# Altium schematic sheet JN5169.SchDoc
size A4; Date: 1/11/2016; Engineer: JBayalas; DocumentNumber: 4; Revision: V2.0; SheetNumber: 4; SheetTotal: 14
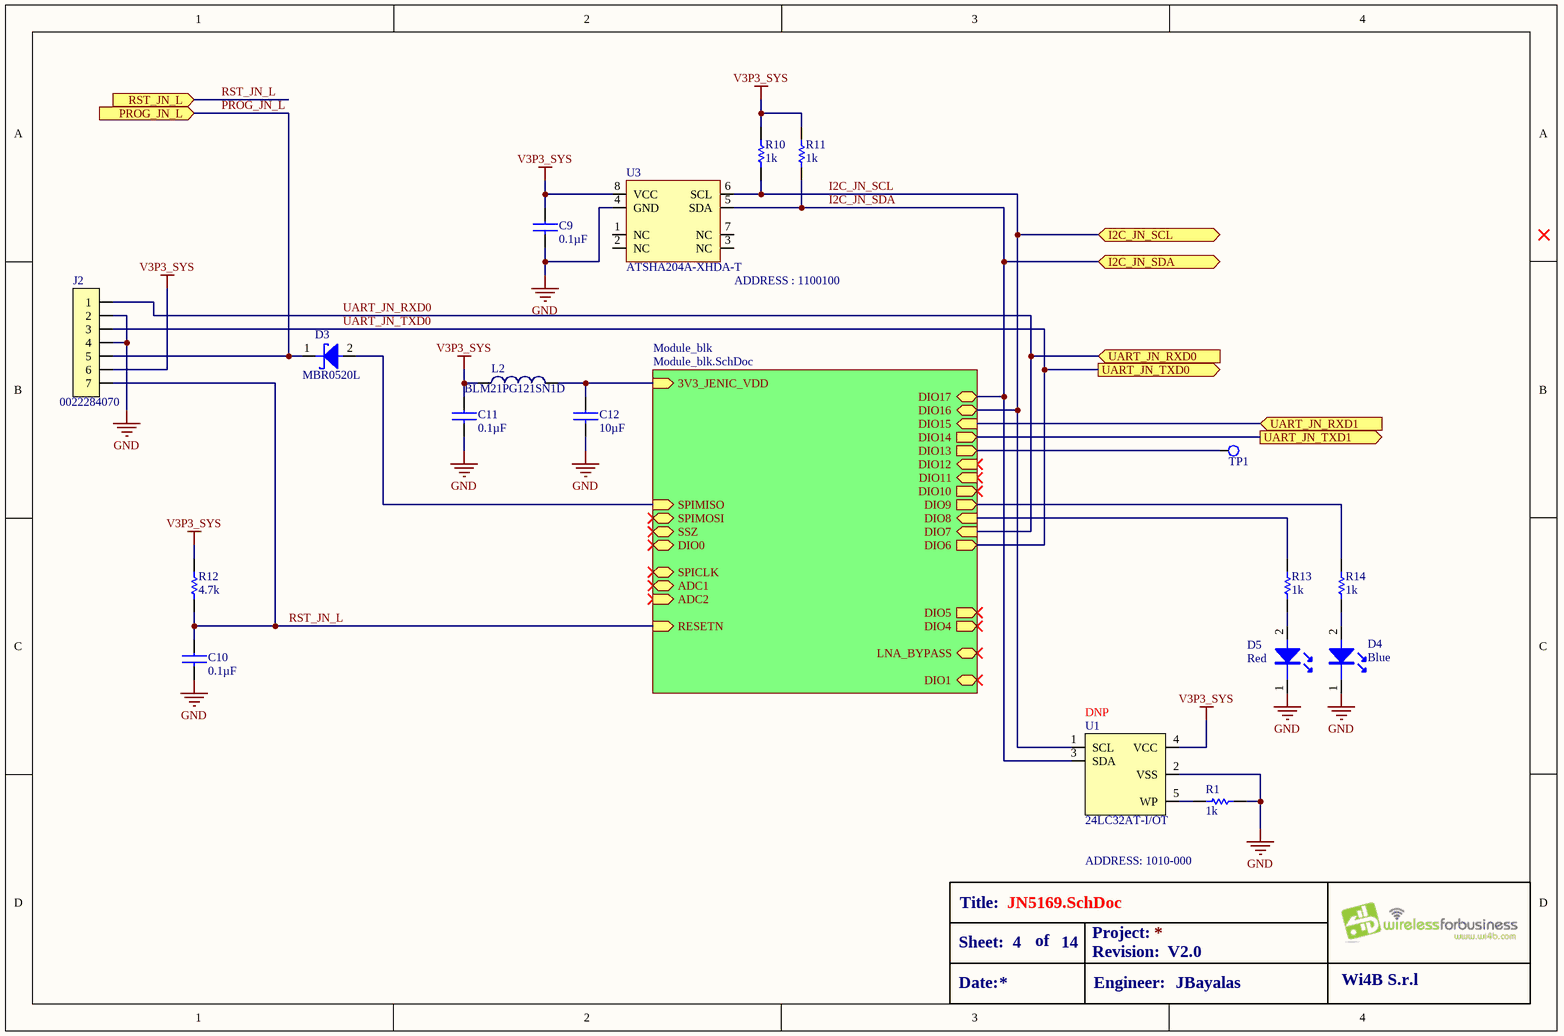
[diagram p0: JN5169.SchDoc]

## Parts
C9  value 0.1µF  [C0402]  (hidden comment: *)
C10  value 0.1µF  [C0402]  (hidden comment: *)
C11  value 0.1µF  [C0402]  (hidden comment: *)
C12  value 10µF  [C0805]  (hidden comment: *)
D3  MBR0520L  [SOD123]
D4  value Blue  [LED-0603 (BLUE)]  (hidden comment: *)
D5  value Red  [LED0805 - (RED)]  (hidden comment: *)
J2  *  [0022284070]  (value not drawn)
L2  *  [0805 INDUCTOR]  (value not drawn)
R1  value 1k  [R0402]  (hidden comment: *)
R10  value 1k  [R0402]  (hidden comment: *)
R11  value 1k  [R0402]  (hidden comment: *)
R12  value 4.7k  [R0603]  (hidden comment: *)
R13  value 1k  [R0603]  (hidden comment: *)
R14  value 1k  [R0603]  (hidden comment: *)
TP1  *  [Test Point 1.27mm]  (value not drawn)
U1  LOAD: DNP  [SOT-23-5]  (hidden comment: *)
U3  ATSHA204A-XHDA-T  [TSSOP-8 (wide Body)]

## Sub-sheets
Module_blk = Module_blk.SchDoc: ADC1 (bidir), SPICLK (bidir), SPIMISO (in), SPIMOSI (bidir), SSZ (bidir), DIO0 (bidir), DIO1 (bidir), LNA_BYPASS (bidir), 3V3_JENIC_VDD (in), DIO10 (out), DIO9 (out), DIO8 (in), DIO7 (in), DIO6 (out), DIO5 (out), DIO4 (out), DIO17 (bidir), DIO16 (bidir), DIO15 (in), DIO14 (out), RESETN (in), DIO13 (out), DIO12 (in), DIO11 (in), ADC2 (in)

## Ports
I2C_JN_SCL (bidir), I2C_JN_SDA (bidir), PROG_JN_L (in), RST_JN_L (in), UART_JN_RXD0 (in), UART_JN_RXD1 (in), UART_JN_TXD0 (out), UART_JN_TXD1 (out)

## Nets
GND: C9.2 C10.2 C11.2 C12.2 D4.1 D5.1 J2.2 J2.4 R1.2 U1.2(VSS) U3.4(GND)
V3P3_SYS: C9.1 C11.1 J2.6 L2.2 R10.2 R11.2 R12.2 U1.4(VCC) U3.8(VCC)
I2C_JN_SCL: R10.1 U1.1(SCL) U3.6(SCL) ; port I2C_JN_SCL, sheet Module_blk/DIO16
I2C_JN_SDA: R11.1 U1.3(SDA) U3.5(SDA) ; port I2C_JN_SDA, sheet Module_blk/DIO17
PROG_JN_L: D3.1(cathode) J2.5 ; port PROG_JN_L
RST_JN_L: C10.1 J2.7 R12.1 ; port RST_JN_L, sheet Module_blk/RESETN
UART_JN_RXD0: J2.1 ; port UART_JN_RXD0, sheet Module_blk/DIO7
UART_JN_RXD1: port UART_JN_RXD1, sheet Module_blk/DIO15
UART_JN_TXD0: J2.3 ; port UART_JN_TXD0, sheet Module_blk/DIO6
UART_JN_TXD1: port UART_JN_TXD1, sheet Module_blk/DIO14
NetC12_1: C12.1 L2.1 ; sheet Module_blk/3V3_JENIC_VDD
NetD3_2: D3.2(anode) ; sheet Module_blk/SPIMISO
NetD4_2: D4.2 R14.2
NetD5_2: D5.2 R13.2
NetR1_1: R1.1 U1.5(WP)
NetR13_1: R13.1 ; sheet Module_blk/DIO8
NetR14_1: R14.1 ; sheet Module_blk/DIO9
NetTP1_1: TP1.1 ; sheet Module_blk/DIO13

Not connected (* = marked no-connect by the designer): U3 1(NC) 2(NC) 3(NC) 7(NC)

## Notes on the sheet
- (near U3) ADDRESS : 1100100
- ADDRESS: 1010-000
- Title:
- Sheet:
- Date:
- of
- Project:
- Revision:
- Engineer:
- Wi4B S.r.l

## Library data of the parts
C9-C11 = CL05B104KO3LNNC: CAP CER 0.1UF 16V X7R 0402; MFT: Samsung Electro-Mechanics America, Inc.; RATING: ±10%, 16V; TYPE: Surface Mount, MLCC; FUNCTION: JENNIC; MPN: CL05B104KO3LNNC
C12 = GRM219R60J106KE19D: CAP CER 10UF 6.3V X5R 0805; MFT: Murata Electronics North America; TYPE: Surface Mount, MLCC; FUNCTION: JENNIC; MPN: GRM219R60J106KE19D; RATING: 6.3V
D3 = MBR0520L: DIODE SCHOTTKY 20V 0.5A SOD123; MFT: ON Semiconductor; TYPE: SMD; RATING: 20V 500MA; FUNCTION: JENNIC; VALUE: MBR0520L; MPN: MBR0520L
D4 = LTST-C191TBKT: LED BLUE CLEAR 0603 SMD; MFT: Lite-On Inc.; TYPE: Surface Mount; FUNCTION: JENNIC; MPN: LTST-C191TBKT
D5 = LS R976-NR-1: LED CHIPLED 633NM RED 0805 SMD; MFT: OSRAM Opto Semiconductors Inc.; FUNCTION: JENNIC; MPN: LS R976-NR-1
J2 = 0022284070: CONN HEADER 7POS .100 VERT TIN; MFT: Molex, LLC; FUNCTION: JENNIC; VALUE: 0022284070; TYPE: TH; RATING: *; MPN: 0022284070
L2 = BLM21PG121SN1D: FERRITE CHIP 120 OHM 0805; MFT: Murata Electronics North America; RATING: 3A; TYPE: Surface Mount; VALUE: 120 Ohm; FUNCTION: JENNIC; MPN: BLM21PG121SN1D
R1 R10 R11 = MCS04020C1001FE000: RES SMD 1K OHM 1% 1/10W 0402; MFT: Vishay Beyschlag; FUNCTION: JENNIC; MPN: MCS04020C1001FE000; TYPE: SMD; RATING: 1/10W; LOAD: *
R12 = ERA-3AEB472V: RES SMD 4.7K OHM 0.1% 1/10W 0603; MFT: Panasonic; FUNCTION: JENNIC; MPN: ERA-3AEB472V; LOAD: *; RATING: 1/10W; TYPE: SMD
R13 R14 = ERJ-3EKF1001V: RES SMD 1K OHM 1% 1/10W 0603; MFT: Panasonic Electronic Components; RATING: 0.1W; FUNCTION: JENNIC; MPN: ERJ-3EKF1001V; TYPE: Surface Mount
TP1 = Test Point: Test Point 1.27mm; FUNCTION: JENNIC
U1 = 24LC32AT-I/OT: IC EEPROM 32KBIT 400KHZ SOT23-5; MFT: Microchip Technology; FUNCTION: JENNIC; VALUE: 24LC32AT-I/OT; TYPE: SMD; RATING: *; MPN: 24LC32AT-I/OT
U3 = ATSHA204A-XHDA-T: IC CRYPTO 4.5KB I2C; MFT: Microchip Technology; FUNCTION: JENNIC; LOAD: *; TYPE: SMD; VALUE: ATSHA204A-XHDA-T; RATING: *; MPN: ATSHA204A-XHDA-T